# Altium schematic sheet RC_Connections.SchDoc
size A
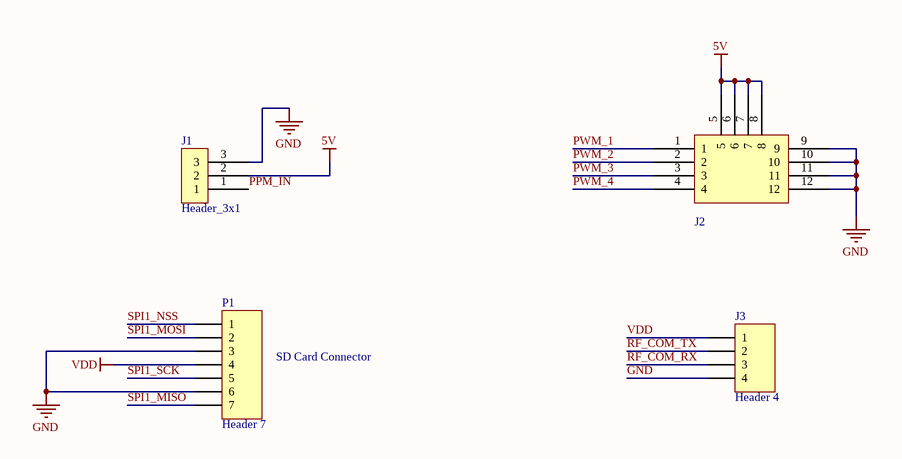
[diagram p0: RC_Connections.SchDoc]

## Parts
J1  Header_3x1  [Header_3x1]
J2  Header 4x3  [Header_4x3]  (value not drawn)
J3  Header 4  [HDR1X4]
P1  Header 7  [HDR1X7]

## Nets
5V: J1.2 J2.5 J2.6 J2.7 J2.8
GND: J1.3 J2.9 J2.10 J2.11 J2.12 J3.4 P1.3 P1.6
VDD: J3.1 P1.4
PPM_IN: J1.1
PWM_1: J2.1
PWM_2: J2.2
PWM_3: J2.3
PWM_4: J2.4
RF_COM_RX: J3.3
RF_COM_TX: J3.2
SPI1_MISO: P1.7
SPI1_MOSI: P1.2
SPI1_NSS: P1.1
SPI1_SCK: P1.5

## Notes on the sheet
- SD Card Connector

## Library data of the parts
J2 = Header_4x3
J3 = Header 4: Header, 4-Pin; LatestRevisionDate: 17-Jul-2002; LatestRevisionNote: Re-released for DXP Platform.; Publisher: Altium Limited
P1 = Header 7: Header, 7-Pin; LatestRevisionDate: 17-Jul-2002; LatestRevisionNote: Re-released for DXP Platform.; Publisher: Altium Limited